# Altium schematic sheet 4_esp8266.SchDoc
size A4
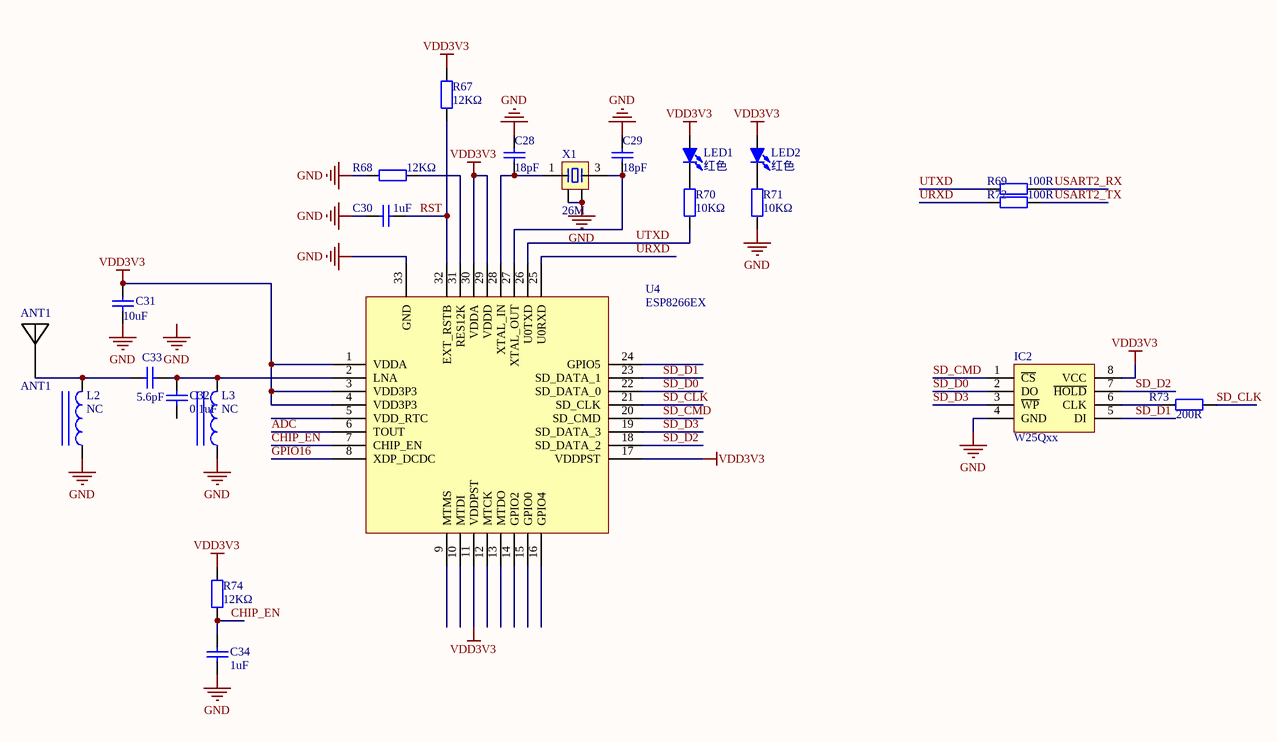
[diagram p0: 4_esp8266.SchDoc]

## Parts
ANT1  ANT1  [WIFI-ANT]
C28  18pF  [LC-0603_C]
C29  18pF  [LC-0603_C]
C30  1uF  [LC-0603_C]
C31  10uF  [LC-0805_C]
C32  0.1uF  [LC-0603_C]
C33  5.6pF  [LC-0603_C]
C34  1uF  [LC-0603_C]
IC2  W25Qxx  [SOP8W_M]
L2  NC  [LC-0603_L]
L3  NC  [LC-0603_L]
LED1  红色  [LED 0603G]
LED2  红色  [LED 0603G]
R67  12KΩ  [LC-0603_R]
R68  12KΩ  [LC-0603_R]
R69  100R  [LC-0603_R]
R70  10KΩ  [LC-0603_R]
R71  10KΩ  [LC-0603_R]
R72  100R  [LC-0603_R]
R73  200R  [LC-0603_R]
R74  12KΩ  [LC-0603_R]
U4  ESP8266EX  [QFN32 5x5_M]
X1  26M  [OSC 2025-4P]

## Nets
GND: C28.1 C29.1 C30.2 C31.1 C34.2 IC2.4(GND) L2.1 L3.1 R68.2 R71.1 U4.33(GND) X1.2 X1.4
VDD3V3: C31.2 IC2.8(VCC) LED1.1(A) LED2.1(A) R67.2 R74.2 U4.1(VDDA) U4.3(VDD3P3) U4.4(VDD3P3) U4.11(VDDPST) U4.17(VDDPST) U4.29(VDDD) U4.30(VDDA)
ADC: U4.6(TOUT)
CHIP_EN: C34.1 R74.1 U4.7(CHIP_EN)
GPIO16: U4.8(XDP_DCDC)
RST: C30.1 R67.1 U4.32(EXT_RSTB)
SD_CLK: R73.1 U4.21(SD_CLK)
SD_CMD: IC2.1(~{CS}) U4.20(SD_CMD)
SD_D0: IC2.2(DO) U4.22(SD_DATA_0)
SD_D1: IC2.5(DI) U4.23(SD_DATA_1)
SD_D2: IC2.7(~{HOLD}) U4.18(SD_DATA_2)
SD_D3: IC2.3(~{WP}) U4.19(SD_DATA_3)
URXD: R72.2 U4.25(U0RXD)
USART2_RX: R69.1
USART2_TX: R72.1
UTXD: R69.2 R70.2 U4.26(U0TXD)
NetANT1_1: ANT1.1 C33.1 L2.2
NetC28_2: C28.2 U4.28(XTAL_IN) X1.1
NetC29_2: C29.2 U4.27(XTAL_OUT) X1.3
NetC32_1: C32.1 C33.2 L3.2 U4.2(LNA)
NetIC2_6: IC2.6(CLK) R73.2
NetLED1_2: LED1.2(K) R70.1
NetLED2_2: LED2.2(K) R71.2
NetR68_1: R68.1 U4.31(RES12K)

Not connected (* = marked no-connect by the designer): C32 2; U4 5(VDD_RTC) 9(MTMS) 10(MTDI) 12(MTCK) 13(MTDO) 14(GPIO2) 15(GPIO0) 16(GPIO4) 24(GPIO5)

## Notes on the sheet
- Labels drawn without touching a wire or pin: GND

## Library data of the parts
ANT1 = ANT1: PCB板载天线; 版权归属: 源创客; BOM名称: PCB板载天线; 学习资源: www.ooocke.com
C28-C30 C32-C34 = 0603 1nF (102) 10% 50V: 贴片电容; ComponentLink1Description: 供应商链接; ComponentLink1URL: http://www.szlcsc.com/product/details_1940.html; Package: 0603; Supplier: LC; SuppliersPartNumber: C1588
C31 = 0805 33pF (330) 5% 50V: 贴片电容; ComponentLink1Description: 供应商链接; ComponentLink1URL: http://www.szlcsc.com/product/details_2166.html; Package: 0805; Supplier: LC; SuppliersPartNumber: C1814
IC2 = W25Qxx: 外置Flash; 版权归属: 源创客; BOM名称: 外置Flash; 学习资源: www.ooocke.com
L2 L3 = 0603 10uH 10%: 贴片电感; ComponentLink1Description: 供应商链接; ComponentLink1URL: http://www.szlcsc.com/product/details_1387.html; Package: 0603; Supplier: LC; SuppliersPartNumber: C1035
LED1 LED2 = LED-SMD: 贴片LED; 版权归属: 源创客; BOM名称: 贴片LED; 学习资源: www.ooocke.com
R67 R68 R70 R71 R73 R74 = 0603 1.8KΩ (1801) 1%: 贴片电阻; ComponentLink1Description: 供应商链接; ComponentLink1URL: http://www.szlcsc.com/product/details_4584.html; Package: 0603; Supplier: LC; SuppliersPartNumber: C4177
R69 R72 = Res1: 贴片电阻; Value: 1K; Published: 8-Jun-2000; LatestRevisionDate: 17-Jul-2002; LatestRevisionNote: Re-released for DXP Platform.; PackageReference: AXIAL-0.4; Publisher: Altium Limited
U4 = ESP8266EX: WIFI芯片
X1 = XTAL-4P: 4脚无源晶振; 版权归属: 源创客; BOM名称: 4脚无源晶振; 学习资源: www.ooocke.com